# Altium project FLXControl.PrjPCB
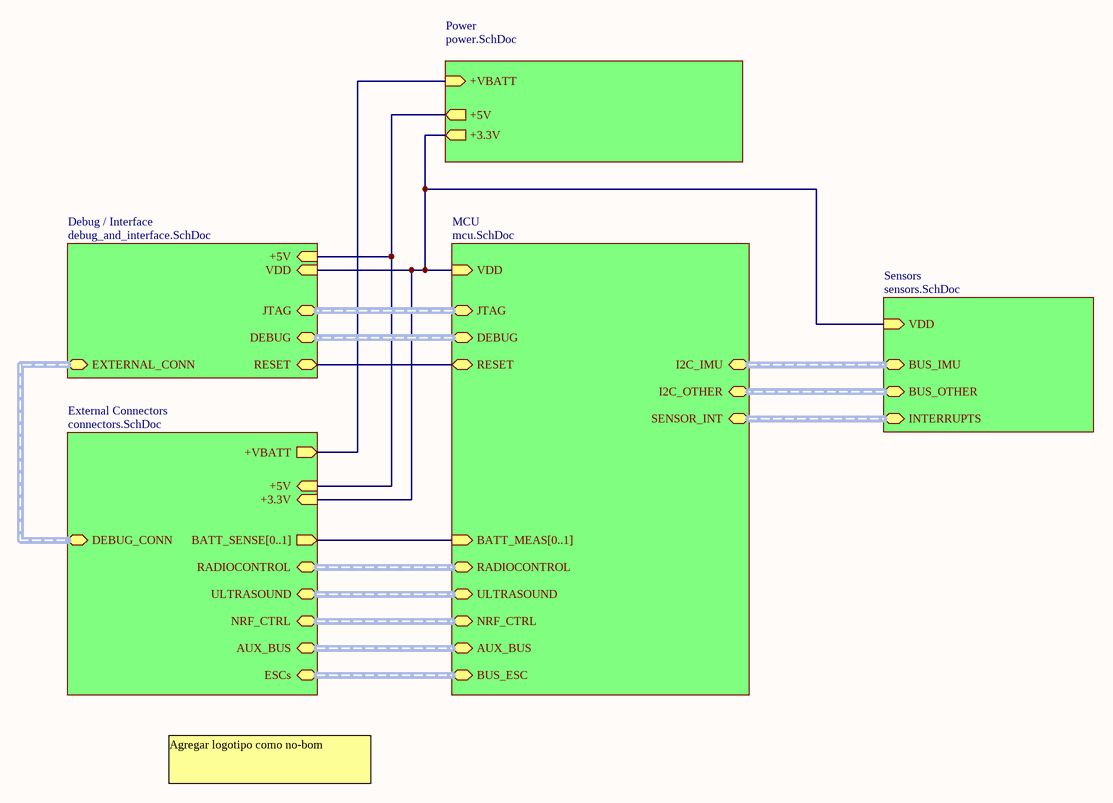
[diagram p0: top_level.SchDoc]
organization: Flying Automatons; Revision: 0
7 sheets, 164 parts. Net scope: hierarchical (ports join the sheet entries above them; power ports are global).
Board file: FLX5.PcbDoc
Sheets:
  top_level.SchDoc
    MCU = mcu.SchDoc
    Sensors = sensors.SchDoc
    Debug / Interface = debug_and_interface.SchDoc
    Power = power.SchDoc
    External Connectors = connectors.SchDoc
      EscConnector1 = esc_connector.SchDoc
      EscConnector2 = esc_connector.SchDoc
      EscConnector3 = esc_connector.SchDoc
      EscConnector4 = esc_connector.SchDoc
      EscConnector5 = esc_connector.SchDoc
      EscConnector6 = esc_connector.SchDoc
      EscConnector7 = esc_connector.SchDoc
      EscConnector8 = esc_connector.SchDoc

## Sheet top_level.SchDoc: Top Level Block Diagram
size A4; DrawnBy: Juan I Carrano; DocumentNumber: 1; SheetNumber: 1; SheetTotal: 6

### Sub-sheets
Debug / Interface = debug_and_interface.SchDoc: VDD (in), JTAG (harness JTAG/SWD), DEBUG (harness Debug), RESET, EXTERNAL_CONN (harness ext_debug), +5V (in)
External Connectors = connectors.SchDoc: ESCs (harness SPI_BUS8), NRF_CTRL (harness nrf_ctrl), RADIOCONTROL (harness RC), BATT_SENSE[0..1] (out), +VBATT (out), AUX_BUS (harness SPI), +5V (in), +3.3V (in), ULTRASOUND (harness ultrasound), DEBUG_CONN (harness ext_debug)
MCU = mcu.SchDoc: JTAG (harness JTAG/SWD), VDD (in), DEBUG (harness Debug), BATT_MEAS[0..1] (in), I2C_IMU (harness i2c), I2C_OTHER (harness i2c), BUS_ESC (harness SPI_BUS8), RESET, RADIOCONTROL (harness RC), SENSOR_INT (harness sensor_interrupts), NRF_CTRL (harness nrf_ctrl), ULTRASOUND (harness ultrasound), AUX_BUS (harness SPI)
Power = power.SchDoc: +VBATT (in), +3.3V (out), +5V (out)
Sensors = sensors.SchDoc: VDD (in), BUS_IMU (harness i2c), INTERRUPTS (harness sensor_interrupts), BUS_OTHER (harness i2c)

### Nets
+5V: sheet Debug / Interface/+5V, sheet Power/+5V, sheet External Connectors/+5V
BATT_MAIN: sheet Power/+VBATT, sheet External Connectors/+VBATT
V3.3: sheet MCU/VDD, sheet Sensors/VDD, sheet Debug / Interface/VDD, sheet Power/+3.3V, sheet External Connectors/+3.3V
Ne~{t}RST_1: sheet MCU/RESET, sheet Debug / Interface/RESET

### Buses and harness runs
bus sheet External Connectors/BATT_SENSE[0..1] = sheet MCU/BATT_MEAS[0..1]
harness sheet Debug / Interface/DEBUG = sheet MCU/DEBUG
harness sheet Debug / Interface/EXTERNAL_CONN = sheet External Connectors/DEBUG_CONN
harness sheet Debug / Interface/JTAG = sheet MCU/JTAG
harness sheet External Connectors/AUX_BUS = sheet MCU/AUX_BUS
harness sheet External Connectors/ESCs = sheet MCU/BUS_ESC
harness sheet External Connectors/NRF_CTRL = sheet MCU/NRF_CTRL
harness sheet External Connectors/RADIOCONTROL = sheet MCU/RADIOCONTROL
harness sheet External Connectors/ULTRASOUND = sheet MCU/ULTRASOUND
harness sheet MCU/I2C_IMU = sheet Sensors/BUS_IMU
harness sheet MCU/I2C_OTHER = sheet Sensors/BUS_OTHER
harness sheet MCU/SENSOR_INT = sheet Sensors/INTERRUPTS

### Notes on the sheet
- Agregar logotipo como no-bom
- Title
- Size:
- Date:
- A4
- Number:
- Time:
- Revision:
- Sheet
- of
- File:
- Drawn by:

## Sheet mcu.SchDoc: Microcontroller
size A4; DrawnBy: Juan I Carrano; DocumentNumber: 3; SheetNumber: 3; SheetTotal: 6
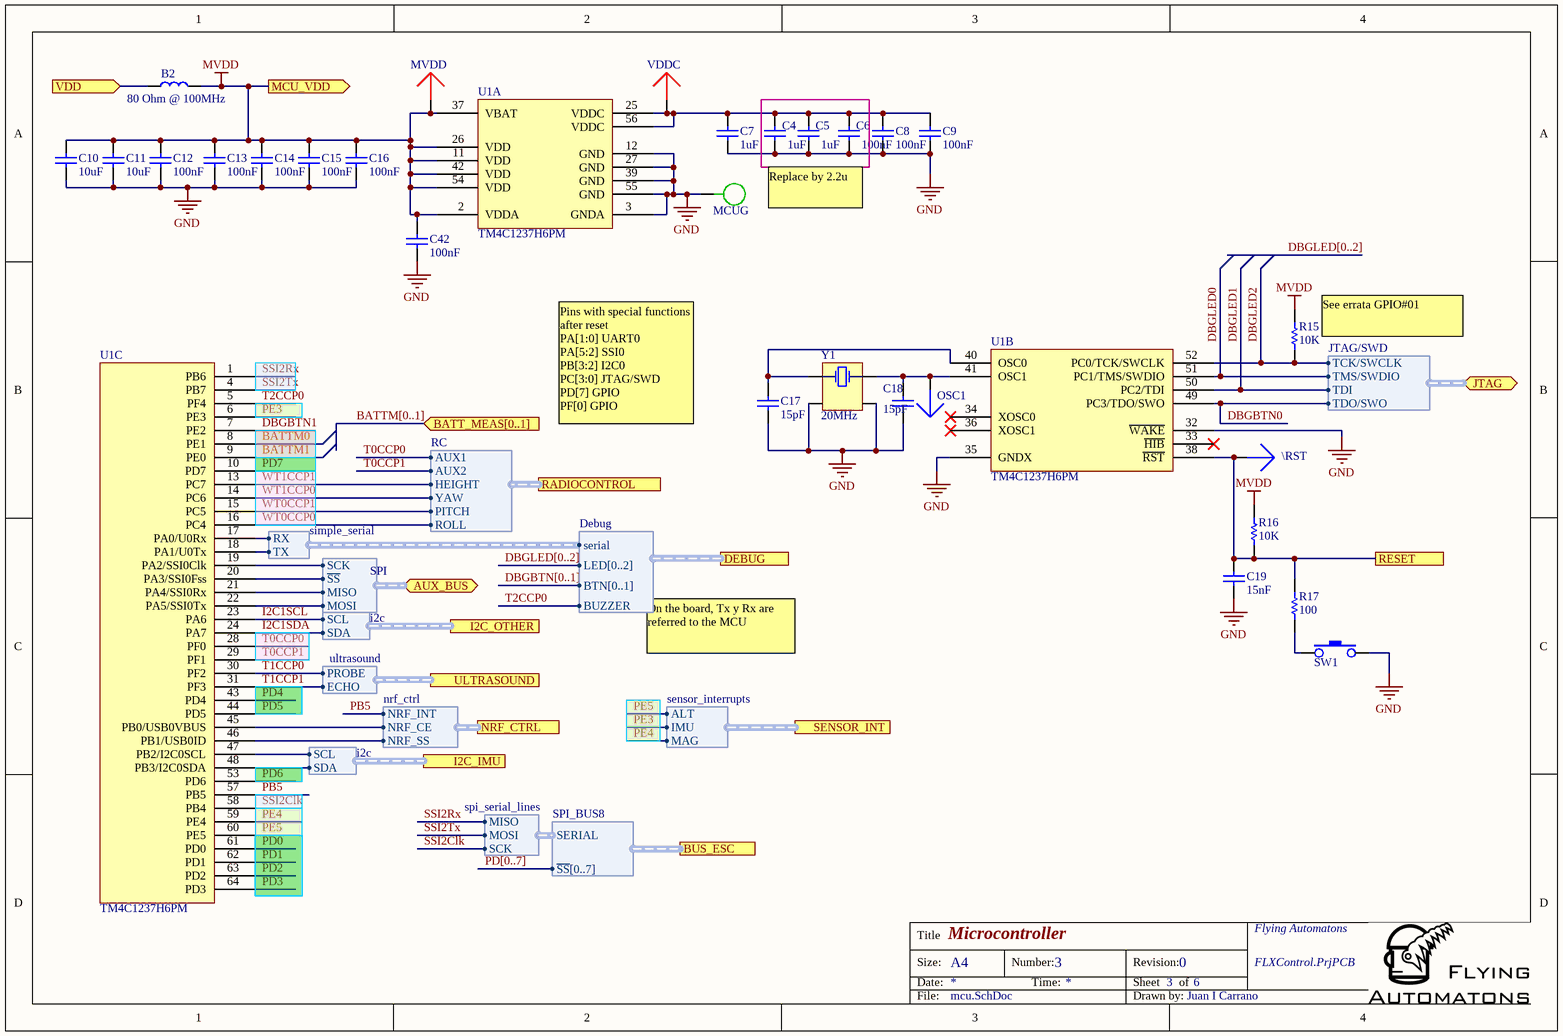
[diagram p1: mcu.SchDoc]

### Parts
\RST  TESTPOINT-ARROW-BLUE  [G-PIN_1mm-CIRCLE]  (value not drawn)
B2  80 Ohm @ 100MHz  [INDC1608L]
C4  1uF  [CAPC1608L]
C5  1uF  [CAPC1608L]
C6  100nF  [CAPC1608L]
C7  1uF  [CAPC1608L]
C8  100nF  [CAPC1608L]
C9  100nF  [CAPC1608L]
C10  10uF  [CAPC3216L]
C11  10uF  [CAPC3216L]
C12  100nF  [CAPC1608L]
C13  100nF  [CAPC1608L]
C14  100nF  [CAPC1608L]
C15  100nF  [CAPC1608L]
C16  100nF  [CAPC1608L]
C17  15pF  [CAPC1608L]
C18  15pF  [CAPC1608L]
C19  15nF  [CAPC1608L]
C42  100nF  [CAPC1608L]
MCUG  TESTPOINT-CIRCLE-GREEN  [G-PIN_1mm-CROSS]  (value not drawn)
MVDD  TESTPOINT-ARROW-RED  [G-PIN_1mm-CIRCLE]  (value not drawn)
OSC1  TESTPOINT-ARROW-BLUE  [G-PIN_1mm-CIRCLE]  (value not drawn)
R15  10K  [RESC1608L]
R16  10K  [RESC1608L]
R17  100  [RESC1608L]
SW1  SWITCH_TACTILE_SPST-2T-NO  [G-SWITCH-M7.1x6.6AS3.25-2T_TH]  (value not drawn)
U1  Manufacturer Part Number: TM4C1237H6PM  [JEDEC_MS-026ACD(D)]  (hidden comment: TM4C1237xxPM)  (parts A,B,C of 3)
VDDC  TESTPOINT-ARROW-RED  [G-PIN_1mm-CIRCLE]  (value not drawn)
Y1  20MHz  [X-EPSO_TSX-3225]

### Ports
AUX_BUS (harness SPI), BATT_MEAS[0..1] (in), BUS_ESC (harness SPI_BUS8), DEBUG (harness Debug), I2C_IMU (harness i2c), I2C_OTHER (harness i2c), JTAG (harness JTAG/SWD), MCU_VDD (out), NRF_CTRL (harness nrf_ctrl), RADIOCONTROL (harness RC), RESET, SENSOR_INT (harness sensor_interrupts), ULTRASOUND (harness ultrasound), VDD (in)

### Harnesses
JTAG/SWD: TCK/SWCLK, TDI, TDO/SWO, TMS/SWDIO
simple_serial: RX, TX
SPI: ~{SS}, MISO, MOSI, SCK
Debug: serial, LED[0..2], BTN[0..1], BUZZER
RC: HEIGHT, ROLL, PITCH, YAW, AUX1, AUX2
SPI_BUS8: SERIAL, ~{SS}[0..7]
sensor_interrupts: ALT, IMU, MAG
i2c: SCL, SDA
ultrasound: PROBE, ECHO
spi_serial_lines: MISO, MOSI, SCK
nrf_ctrl: NRF_SS, NRF_CE, NRF_INT

### Nets
GND: C4.2 C5.2 C6.2 C7.2 C8.2 C9.2 C10.2 C11.2 C12.2 C13.2 C14.2 C15.2 C16.2 C17.2 C18.2 C19.2 C42.2 MCUG.1 SW1.2 U1.3(GNDA) U1.12(GND) U1.27(GND) U1.32(~{WAKE}) U1.35(GNDX) U1.39(GND) U1.55(GND) Y1.2 Y1.4
MVDD: B2.2 C10.1 C11.1 C12.1 C13.1 C14.1 C15.1 C16.1 C42.1 MVDD.1 R15.1 R16.1 U1.2(VDDA) U1.11(VDD) U1.26(VDD) U1.37(VBAT) U1.42(VDD) U1.54(VDD) ; port MCU_VDD
V3.3: B2.1 ; port VDD
BATTM0: U1.8(PE1)
BATTM1: U1.9(PE0)
DBGBTN0: U1.49(PC3/TDO/SWO) ; port JTAG.TDO/SWO  [project net BTN0]
DBGBTN1: U1.7(PE2)  [project net BTN1]
DBGLED0: U1.51(PC1/TMS/SWDIO) ; port JTAG.TMS/SWDIO
DBGLED1: U1.50(PC2/TDI) ; port JTAG.TDI
DBGLED2: R15.2 U1.52(PC0/TCK/SWCLK) ; port JTAG.TCK/SWCLK
I2C1SCL: U1.23(PA6) ; port I2C_OTHER.SCL
I2C1SDA: U1.24(PA7) ; port I2C_OTHER.SDA
NRF_CE: U1.45(PB0/USB0VBUS) ; port NRF_CTRL.NRF_CE
NRF_CSN: U1.46(PB1/USB0ID) ; port NRF_CTRL.NRF_SS
NRF_MISO: U1.21(PA4/SSI0Rx) ; port AUX_BUS.MISO
NRF_MOSI: U1.22(PA5/SSI0Tx) ; port AUX_BUS.MOSI
NRF_SCK: U1.19(PA2/SSI0Clk) ; port AUX_BUS.SCK
PB5: U1.57(PB5) ; port NRF_CTRL.NRF_INT  [project net NRF_IRQ]
PD0: U1.61(PD0)
PD1: U1.62(PD1)
PD2: U1.63(PD2)
PD3: U1.64(PD3)
PD4: U1.43(PD4)
PD5: U1.44(PD5)
PD6: U1.53(PD6)
PD7: U1.10(PD7)
PE3: U1.6(PE3) ; port SENSOR_INT.IMU  [project net INT_IMU]
PE4: U1.59(PE4) ; port SENSOR_INT.MAG  [project net INT_MAG]
PE5: U1.60(PE5) ; port SENSOR_INT.ALT  [project net INT_ALT]
SSI2Clk: U1.58(PB4) ; harness spi_serial_lines.SCK
SSI2Rx: U1.1(PB6) ; harness spi_serial_lines.MISO
SSI2Tx: U1.4(PB7) ; harness spi_serial_lines.MOSI
T0CCP0: U1.28(PF0) ; port RADIOCONTROL.AUX1
T0CCP1: U1.29(PF1) ; port RADIOCONTROL.AUX2
T1CCP0: U1.30(PF2) ; port ULTRASOUND.PROBE
T1CCP1: U1.31(PF3) ; port ULTRASOUND.ECHO
T2CCP0: U1.5(PF4) ; port DEBUG.BUZZER
WT0CCP0: U1.16(PC4) ; port RADIOCONTROL.ROLL
WT0CCP1: U1.15(PC5) ; port RADIOCONTROL.PITCH
WT1CCP0: U1.14(PC6) ; port RADIOCONTROL.YAW
WT1CCP1: U1.13(PC7) ; port RADIOCONTROL.HEIGHT
Ne~{t}RST_1: \RST.1 C19.1 R16.2 R17.1 U1.38(~{RST}) ; port RESET
NetASS_1: U1.20(PA3/SSI0Fss) ; port AUX_BUS.~{SS}
NetC4_1: C4.1 C5.1 C6.1 C7.1 C8.1 C9.1 U1.25(VDDC) U1.56(VDDC) VDDC.1
NetC17_1: C17.1 U1.40(OSC0) Y1.1
NetC18_1: C18.1 OSC1.1 U1.41(OSC1) Y1.3
NetDRX_1: U1.17(PA0/U0Rx) ; harness simple_serial.RX
NetDTX_1: U1.18(PA1/U0Tx) ; harness simple_serial.TX
NetR17_2: R17.2 SW1.1
NetR23_2: U1.47(PB2/I2C0SCL) ; port I2C_IMU.SCL
NetR24_2: U1.48(PB3/I2C0SDA) ; port I2C_IMU.SDA

Not connected (* = marked no-connect by the designer): U1 33(~{HIB})* 34(XOSC0)* 36(XOSC1)*

### Buses and harness runs
bus BATTM[0..1] = port BATT_MEAS[0..1]
bus DBGBTN[0..1]
bus DBGLED[0..2]
bus PD[0..7]

### Notes on the sheet
- Replace by 2.2u
- (near R15) See errata GPIO#01
- Pins with special functions after reset
  PA[1:0] UART0
  PA[5:2] SSI0
  PB[3:2] I2C0
  PC[3:0] JTAG/SWD
  PD[7] GPIO
  PF[0] GPIO
- On the board, Tx y Rx are referred to the MCU
- Title
- Size:
- Date:
- A4
- Number:
- Time:
- Revision:
- Sheet
- of
- File:
- Drawn by:

### Library data of the parts
\RST OSC1 = TESTP_SIG_1mm: Tespoint; Name: TESTP_SIG_1mm
B2 = FERR_80/100M_0603_600m: FERRITE CHIP 80 OHM 600MA 0603; Manufacturer: Samsung Electro-Mechanics America, Inc; Manufacturer Part Number: CIM10U800NC; Name: FERR_80/100M_0603_600m; Value: 80 Ohm @ 100MHz; Supplier 1: Digi-Key; Supplier Part Number 1: 1276-6386-1-ND
C4 C5 C7 = CAP_1u_0603_25V_X5R_10%: CAP CER 1UF 25V 10% X5R 0603; Manufacturer Part Number: TMK107BJ105KA-T; Name: CAP_1u_0603_25V_X5R_10%; Value: 1uF; Supplier 1: Digi-Key; Supplier Part Number 1: 587-1248-1-ND
C6 C8 C9 C12-C16 C42 = CAP_100n_0603_50V_Y5V: CAP CER 0.1UF 50V Y5V 0603; Manufacturer Part Number: CC0603ZRY5V9BB104; Name: CAP_100n_0603_50V_Y5V; Value: 100nF; Supplier 1: Digi-Key; Supplier Part Number 1: 311-1343-1-ND
C10 C11 = CAP_10u_1206_25V_Y5V: CAP CER 10UF 25V Y5V 1206; Manufacturer Part Number: TMK316F106ZL-T; Name: CAP_10u_1206_25V_Y5V; Value: 10uF; Supplier 1: Digi-Key; Supplier Part Number 1: 587-1353-1-ND
C17 C18 = CAP_15p_0603_50V_NP0_5%: CAP CER 15PF 50V 5% NP0 0603; Manufacturer: Samsung Electro-Mechanics America, Inc; Manufacturer Part Number: CL10C150JB8NCNC; Name: CAP_15p_0603_50V_NP0_5%; Value: 15pF; Supplier 1: Digi-Key; Supplier Part Number 1: 1276-2190-1-ND
C19 = CAP_15n_0603_50V_X7R_10%: CAP CER 0.015UF 50V 10% X7R 0603; Manufacturer Part Number: CL10B153KB8SFNC; Name: CAP_15n_0603_50V_X7R_10%; Value: 15nF; Supplier 1: Digi-Key; Supplier Part Number 1: 1276-1967-1-ND
MCUG = TESTP_GND_GREEN_1mm: Ground Connection; Name: TESTP_GND_GREEN_1mm
MVDD VDDC = TESTP_PWR_1mm: Tespoint for Power Trace; Name: TESTP_PWR_1mm
R15 R16 = RES_10K_0603_0W1_1%: RES 10K OHM 1/10W 5% 0603; Manufacturer Part Number: RC1608J103CS; Name: RES_10K_0603_0W1_1%; Value: 10K; Supplier 1: Digi-Key; Supplier Part Number 1: 1276-5086-1-ND
R17 = RES_100_0603_0W1_1%: RES 100 OHM 1/10W 5% 0603 SMD; Manufacturer Part Number: RC0603JR-07100RL; Name: RES_100_0603_0W1_1%; Value: 100; Supplier 1: Digi-Key; Supplier Part Number 1: 311-100GRCT-ND
SW1 = SW_TACT_7.1x6.6mm_S_A5_TH: SWITCH TACTILE SPST-NO 0.05A 12V; Manufacturer: TE Connectivity; Manufacturer Part Number: 1825027-8; Name: SW_TACT_7.1x6.6mm_S_A5_TH; Supplier 1: Digi-Key; Supplier Part Number 1: 450-1657-ND
U1 = x-TI_TM4C1237H6PM: MCU Tiva C-Series 64 Pin LQFP; Manufacturer: Texas Instruments; Name: x-TI_TM4C1237H6PM
Y1 = XTAL_20M_SMD_9p: CRYSTAL 20MHZ 9PF SMD; Manufacturer: EPSON; Manufacturer Part Number: TSX-3225 20.0000MF20G-AC3; Drawn By: Juan I Carrano; Name: XTAL_20M_SMD_9p; Value: 20MHz; Supplier 1: Digi-Key; Supplier Part Number 1: SER3629CT-ND

## Sheet sensors.SchDoc: On-Board Sensors
size A4; DrawnBy: Juan I Carrano; DocumentNumber: 4; SheetNumber: 4; SheetTotal: 6
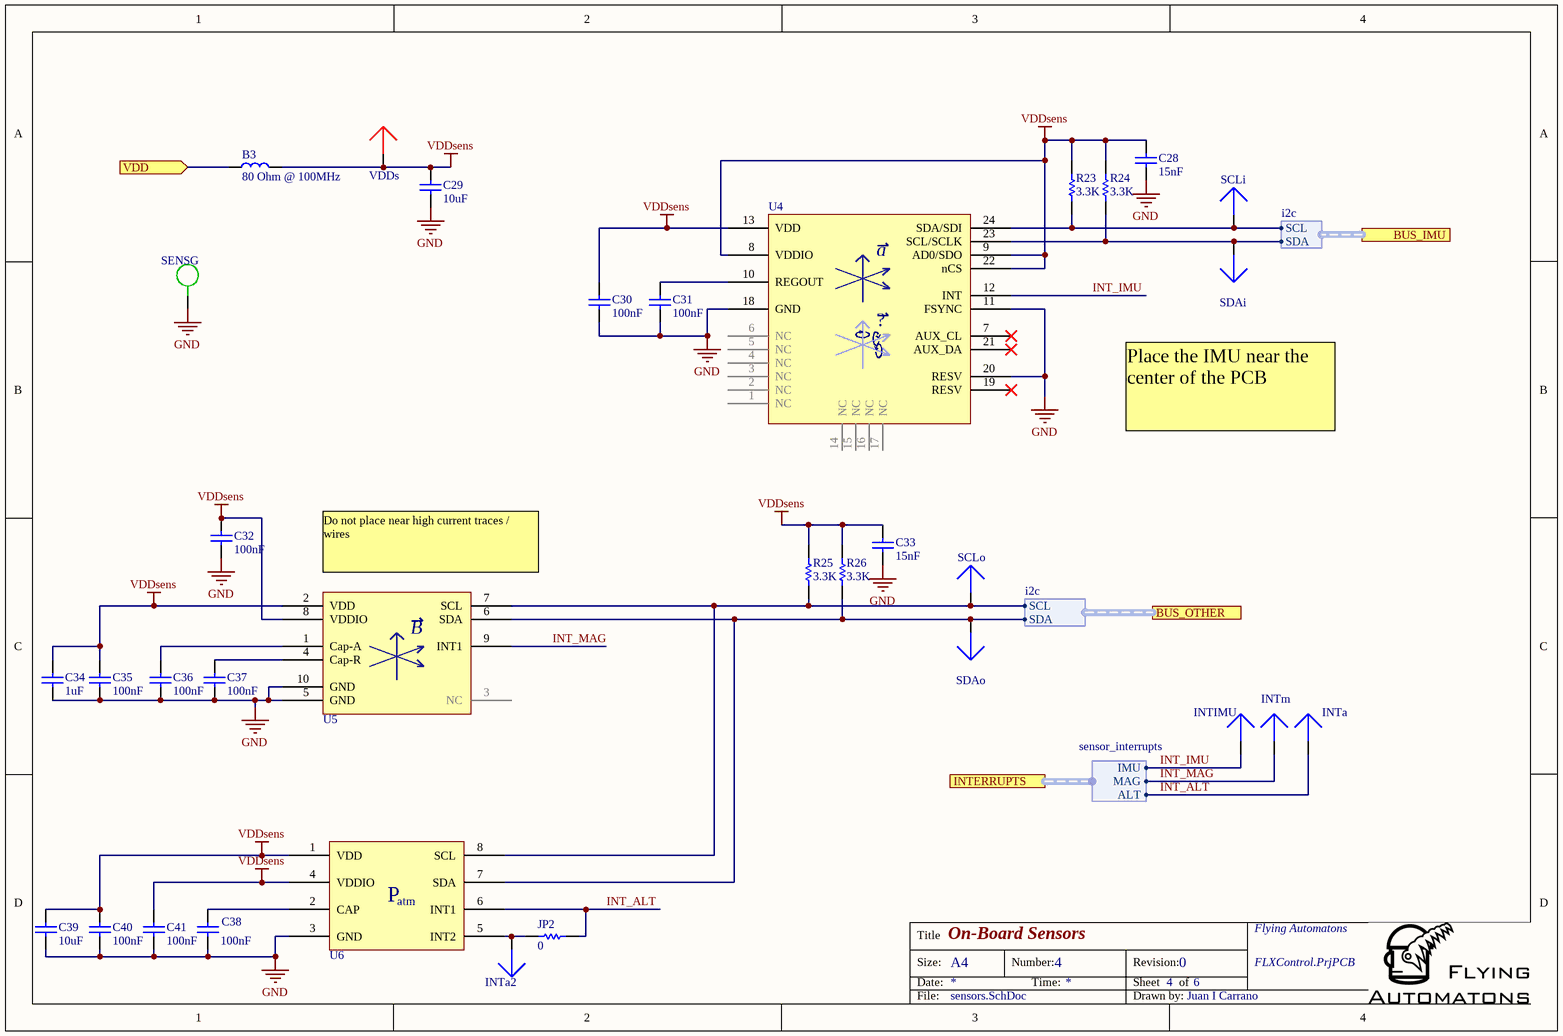
[diagram p2: sensors.SchDoc]

### Parts
B3  80 Ohm @ 100MHz  [INDC1608L]
C28  15nF  [CAPC1608L]
C29  10uF  [CAPC3216L]
C30  100nF  [CAPC1608L]
C31  100nF  [CAPC1608L]
C32  100nF  [CAPC1608L]
C33  15nF  [CAPC1608L]
C34  1uF  [CAPC1608L]
C35  100nF  [CAPC1608L]
C36  100nF  [CAPC1608L]
C37  100nF  [CAPC1608L]
C38  100nF  [CAPC1608L]
C39  10uF  [CAPC3216L]
C40  100nF  [CAPC1608L]
C41  100nF  [CAPC1608L]
INTa  TESTPOINT-ARROW-BLUE  [G-PIN_1mm-CIRCLE]  (value not drawn)
INTa2  TESTPOINT-ARROW-BLUE  [G-PIN_1mm-CIRCLE]  (value not drawn)
INTIMU  TESTPOINT-ARROW-BLUE  [G-PIN_1mm-CIRCLE]  (value not drawn)
INTm  TESTPOINT-ARROW-BLUE  [G-PIN_1mm-CIRCLE]  (value not drawn)
JP2  0  [RESC1608L]
R23  3.3K  [RESC1608L]
R24  3.3K  [RESC1608L]
R25  3.3K  [RESC1608L]
R26  3.3K  [RESC1608L]
SCLi  TESTPOINT-ARROW-BLUE  [G-PIN_1mm-CIRCLE]  (value not drawn)
SCLo  TESTPOINT-ARROW-BLUE  [G-PIN_1mm-CIRCLE]  (value not drawn)
SDAi  TESTPOINT-ARROW-BLUE  [G-PIN_1mm-CIRCLE]  (value not drawn)
SDAo  TESTPOINT-ARROW-BLUE  [G-PIN_1mm-CIRCLE]  (value not drawn)
SENSG  TESTPOINT-CIRCLE-GREEN  [G-PIN_1mm-CROSS]  (value not drawn)
U4  MPU-6500  [QFN40P300X300X95-24N]  (value not drawn)
U5  MAG3110  [SON40P200X200X80-10WL]  (value not drawn)
U6  MPL3115A2  [x-FREE_2053-01(LGA8)]  (value not drawn)
VDDs  TESTPOINT-ARROW-RED  [G-PIN_1mm-CIRCLE]  (value not drawn)

### Ports
BUS_IMU (harness i2c), BUS_OTHER (harness i2c), INTERRUPTS (harness sensor_interrupts), VDD (in)

### Harnesses
sensor_interrupts: IMU, MAG, ALT
i2c: SCL, SDA

### Nets
GND: C28.2 C29.2 C30.2 C31.1 C32.2 C33.2 C34.2 C35.2 C36.2 C37.2 C38.2 C39.2 C40.2 C41.2 SENSG.1 U4.11(FSYNC) U4.18(GND) U4.20(RESV) U5.5(GND) U5.10(GND) U6.3(GND)
V3.3: B3.1 ; port VDD
VDDsens: B3.2 C28.1 C29.1 C30.1 C32.1 C33.1 C34.1 C35.1 C39.1 C40.1 C41.1 R23.1 R24.1 R25.1 R26.1 U4.8(VDDIO) U4.9(AD0/SDO) U4.13(VDD) U4.22(nCS) U5.2(VDD) U5.8(VDDIO) U6.1(VDD) U6.4(VDDIO) VDDs.1
I2C1SCL: R25.2 SCLo.1 U5.7(SCL) U6.8(SCL) ; port BUS_OTHER.SCL
I2C1SDA: R26.2 SDAo.1 U5.6(SDA) U6.7(SDA) ; port BUS_OTHER.SDA
INT_ALT: INTa.1 JP2.1 U6.6(INT1) ; port INTERRUPTS.ALT
INT_IMU: INTIMU.1 U4.12(INT) ; port INTERRUPTS.IMU
INT_MAG: INTm.1 U5.9(INT1) ; port INTERRUPTS.MAG
NetC31_2: C31.2 U4.10(REGOUT)
NetC36_1: C36.1 U5.1(Cap-A)
NetC37_1: C37.1 U5.4(Cap-R)
NetC38_1: C38.1 U6.2(CAP)
NetINTa2_1: INTa2.1 JP2.2 U6.5(INT2)
NetR23_2: R23.2 SCLi.1 U4.24(SDA/SDI) ; port BUS_IMU.SCL
NetR24_2: R24.2 SDAi.1 U4.23(SCL/SCLK) ; port BUS_IMU.SDA

Not connected (* = marked no-connect by the designer): U4 1(NC) 2(NC) 3(NC) 4(NC) 5(NC) 6(NC) 7(AUX_CL)* 14(NC) 15(NC) 16(NC) 17(NC) 19(RESV)* 21(AUX_DA)*; U5 3(NC)

### Notes on the sheet
- Place the IMU near the center of the PCB
- (near U5) Do not place near high current traces / wires
- Title
- Size:
- Date:
- A4
- Number:
- Time:
- Revision:
- Sheet
- of
- File:
- Drawn by:
- (in symbol MAG3110) B
- (in symbol MPL3115A2) P; atm
- (in symbol MPU-6500) a; ?

### Library data of the parts
B3 = FERR_80/100M_0603_600m: as B2 on sheet mcu; Name: FERR_80/100M_0603_600m; Value: 80 Ohm @ 100MHz; Supplier 1: Digi-Key; Supplier Part Number 1: 1276-6386-1-ND
C28 C33 = CAP_15n_0603_50V_X7R_10%: as C19 on sheet mcu; Name: CAP_15n_0603_50V_X7R_10%; Value: 15nF; Supplier 1: Digi-Key; Supplier Part Number 1: 1276-1967-1-ND
C29 C39 = CAP_10u_1206_25V_Y5V: as C10 on sheet mcu; Name: CAP_10u_1206_25V_Y5V; Value: 10uF; Supplier 1: Digi-Key; Supplier Part Number 1: 587-1353-1-ND
C30-C32 C35-C38 C40 C41 = CAP_100n_0603_50V_Y5V: as C6 on sheet mcu; Name: CAP_100n_0603_50V_Y5V; Value: 100nF; Supplier 1: Digi-Key; Supplier Part Number 1: 311-1343-1-ND
C34 = CAP_1u_0603_25V_X5R_10%: as C4 on sheet mcu; Name: CAP_1u_0603_25V_X5R_10%; Value: 1uF; Supplier 1: Digi-Key; Supplier Part Number 1: 587-1248-1-ND
INTa INTa2 INTIMU INTm SCLi SCLo SDAi SDAo = TESTP_SIG_1mm: Tespoint; Name: TESTP_SIG_1mm
JP2 = RES_0_0603_0W1_1%: RES 0.0 OHM 1/10W JUMP 0603; Manufacturer Part Number: RC1608J000CS; Name: RES_0_0603_0W1_1%; Value: 0; Supplier 1: Digi-Key; Supplier Part Number 1: 1276-3510-1-ND
R23-R26 = RES_3K3_0603_0W1_1%: RES 3.3K OHM 1/10W 1% 0603 SMD; Manufacturer: Rohm Semiconductor; Manufacturer Part Number: MCR03ERTF3301; Name: RES_3K3_0603_0W1_1%; Value: 3.3K; Supplier 1: Digi-Key; Supplier Part Number 1: RHM3.30KCFCT-ND
SENSG = TESTP_GND_GREEN_1mm: Ground Connection; Name: TESTP_GND_GREEN_1mm
U4 = MPU-6500: GYRO/ACCELEROMETER 6AXIS 24QFN; Manufacturer: Invensense; Name: MPU-6500; Manufacturer Part Number: MPU-6500; Value: MPU-6500; Supplier 1: Digi-Key; Supplier Part Number 1: 1428-1011-1-ND
U5 = MAG3110: XYZ Digital Magnetometer I2C; Manufacturer: Freescale Semiconductor; Manufacturer Part Number: MAG3110FCR1; Name: MAG3110; Value: MAG3110
U6 = MPL3115A2: IC ALTIMETER I2C VERSION 8LGA; Manufacturer: Freescale Semiconductor; Name: MPL3115A2; Manufacturer Part Number: MPL3115A2; Value: MPL3115A2; Supplier 1: Digi-Key; Supplier Part Number 1: MPL3115A2-ND
VDDs = TESTP_PWR_1mm: Tespoint for Power Trace; Name: TESTP_PWR_1mm

## Sheet debug_and_interface.SchDoc: Debugging / User Interface
size A4; DrawnBy: Juan I Carrano; DocumentNumber: 5; SheetNumber: 5; SheetTotal: 6
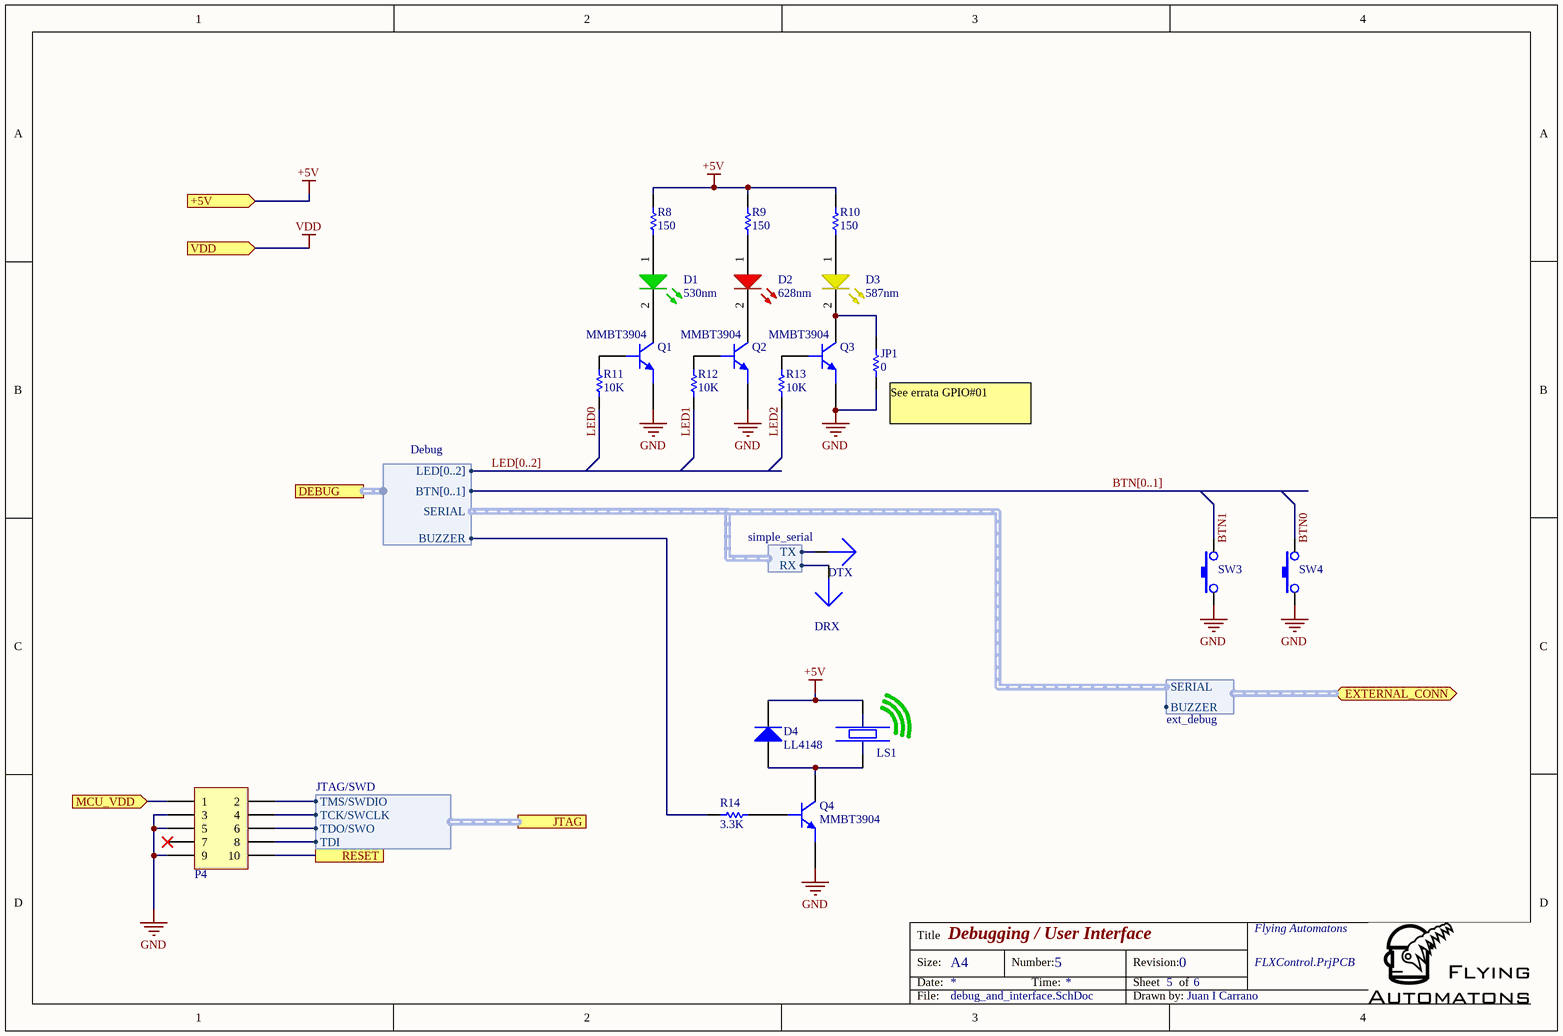
[diagram p3: debug_and_interface.SchDoc]

### Parts
D1  value 530nm  [DSO-F2/D3.4]  (hidden comment: LED-GREEN)
D2  value 628nm  [DSO-F2/D3.4]  (hidden comment: LED-RED)
D3  value 587nm  [DSO-F2/D3.4]  (hidden comment: LED-YELLOW)
D4  value LL4148  [SOD-80]  (hidden comment: DIODE)
DRX  TESTPOINT-ARROW-BLUE  [G-PIN_1mm-CIRCLE]  (value not drawn)
DTX  TESTPOINT-ARROW-BLUE  [G-PIN_1mm-CIRCLE]  (value not drawn)
JP1  0  [RESC1608L]
LS1  (no value)  [TWO_WIRE_HOLE_M0.9D3P]
P4  HEADER-5x2S  [G-HEADER_5x2I.05P_SM]  (value not drawn)
Q1  value MMBT3904  [SOT23-3L]  (hidden comment: BJT-NPN-BEC)
Q2  value MMBT3904  [SOT23-3L]  (hidden comment: BJT-NPN-BEC)
Q3  value MMBT3904  [SOT23-3L]  (hidden comment: BJT-NPN-BEC)
Q4  value MMBT3904  [SOT23-3L]  (hidden comment: BJT-NPN-BEC)
R8  150  [RESC1608L]
R9  150  [RESC1608L]
R10  150  [RESC1608L]
R11  10K  [RESC1608L]
R12  10K  [RESC1608L]
R13  10K  [RESC1608L]
R14  3.3K  [RESC1608L]
SW3  SWITCH_TACTILE_SPST-2T-NO  [G-SWITCH-M7.1x6.6AS3.25-2T_TH]  (value not drawn)
SW4  SWITCH_TACTILE_SPST-2T-NO  [G-SWITCH-M7.1x6.6AS3.25-2T_TH]  (value not drawn)

### Ports
+5V (in), DEBUG (harness Debug), EXTERNAL_CONN (harness ext_debug), JTAG (harness JTAG/SWD), MCU_VDD (in), RESET, VDD (in)

### Harnesses
simple_serial: RX, TX
JTAG/SWD: TCK/SWCLK, TDI, TDO/SWO, TMS/SWDIO
Debug: SERIAL, BTN[0..1], BUZZER, LED[0..2]
ext_debug: BUZZER, SERIAL

### Nets
+5V: D4.2(K) LS1.1 R8.1 R9.1 R10.1 ; port +5V
GND: JP1.2 P4.3 P4.5 P4.9 Q1.2(E) Q2.2(E) Q3.2(E) Q4.2(E) SW3.1 SW4.1
BTN0: P4.6 SW4.2 ; port JTAG.TDO/SWO
BTN1: SW3.2
LED0: P4.2 R11.2 ; port JTAG.TMS/SWDIO  [project net DBGLED0]
LED1: P4.8 R12.2 ; port JTAG.TDI  [project net DBGLED1]
LED2: P4.4 R13.2 ; port JTAG.TCK/SWCLK  [project net DBGLED2]
T2CCP0: R14.2 ; port DEBUG.BUZZER
Ne~{t}RST_1: P4.10 ; port RESET
NetD1_1: D1.1(A) R8.2
NetD1_2: D1.2(K) Q1.3(C)
NetD2_1: D2.1(A) R9.2
NetD2_2: D2.2(K) Q2.3(C)
NetD3_1: D3.1(A) R10.2
NetD3_2: D3.2(K) JP1.1 Q3.3(C)
NetD4_1: D4.1(A) LS1.2 Q4.3(C)
NetDRX_1: DRX.1 ; harness simple_serial.RX
NetDTX_1: DTX.1 ; harness simple_serial.TX
NetP4_1: P4.1 ; port MCU_VDD
NetQ1_1: Q1.1(B) R11.1
NetQ2_1: Q2.1(B) R12.1
NetQ3_1: Q3.1(B) R13.1
NetQ4_1: Q4.1(B) R14.1

Not connected (* = marked no-connect by the designer): P4 7*

### Buses and harness runs
bus BTN[0..1]
bus LED[0..2]

### Notes on the sheet
- (near JP1) See errata GPIO#01
- Title
- Size:
- Date:
- A4
- Number:
- Time:
- Revision:
- Sheet
- of
- File:
- Drawn by:

### Library data of the parts
D1 = LED_GREEN_0603_530: LED CHIPLED 570NM GREEN 0603 SMD; Manufacturer: OSRAM Opto Semiconductors Inc; Manufacturer Part Number: LG Q971-KN-1; Drawn By: Juan I Carrano; Name: LED_GREEN_0603_530; Supplier 1: Digi-Key; Supplier Part Number 1: 475-1409-1-ND
D2 = LED_RED_0603_628: LED POINTLED 628NM SUPER RED SMD; Manufacturer: OSRAM Opto Semiconductors Inc; Manufacturer Part Number: LS Q971-KN-1; Drawn By: Juan I Carrano; Name: LED_RED_0603_628; Supplier 1: Digi-Key; Supplier Part Number 1: 475-3016-1-ND
D3 = LED_YELLOW_0603_587: LED CHIPLED 587NM YLW 0603 SMD; Manufacturer: OSRAM Opto Semiconductors Inc; Manufacturer Part Number: LY Q976-P1S2-36; Drawn By: Juan I Carrano; Name: LED_YELLOW_0603_587; Supplier 1: Digi-Key; Supplier Part Number 1: 475-2558-1-ND
D4 = LL4148: DIODE SMALL SIG 100V 0.2A SOD80; Manufacturer: Fairchild Semiconductor; Drawn By: Juan I Carrano; Name: LL4148; Manufacturer Part Number: LL4148; Supplier 1: Digi-Key; Supplier Part Number 1: LL4148FSCT-ND
DRX DTX = TESTP_SIG_1mm: Tespoint; Name: TESTP_SIG_1mm
JP1 = RES_0_0603_0W1_1%: as JP2 on sheet sensors; Name: RES_0_0603_0W1_1%; Value: 0; Supplier 1: Digi-Key; Supplier Part Number 1: 1276-3510-1-ND
LS1 = PIEZO_BUZZER_EXT: Piezoelectric buzzer (soldered wire); Drawn By: Juan I Carrano; Name: PIEZO_BUZZER_EXT
P4 = HEADER_5x2_50mil_U: CONN HEADER 10POS DL UNSHRD SMD; Name: HEADER_5x2_50mil_U
Q1-Q4 = MMBT3904: TRANSISTOR NPN 40V 0.2A SOT23; Manufacturer: NXP Semiconductors; Name: MMBT3904; Manufacturer Part Number: MMBT3904; Supplier 1: Digi-Key; Supplier Part Number 1: 568-4510-1-ND
R8-R10 = RES_150_0603_0W1_1%: RES 150 OHM 1/10W 1% 0603 SMD; Manufacturer: Rohm Semiconductor; Manufacturer Part Number: MCR03ERTF1500; Name: RES_150_0603_0W1_1%; Value: 150; Supplier 1: Digi-Key; Supplier Part Number 1: RHM150CFCT-ND
R11-R13 = RES_10K_0603_0W1_1%: as R15 on sheet mcu; Name: RES_10K_0603_0W1_1%; Value: 10K; Supplier 1: Digi-Key; Supplier Part Number 1: 1276-5086-1-ND
R14 = RES_3K3_0603_0W1_1%: as R23 on sheet sensors; Name: RES_3K3_0603_0W1_1%; Value: 3.3K; Supplier 1: Digi-Key; Supplier Part Number 1: RHM3.30KCFCT-ND
SW3 SW4 = SW_TACT_7.1x6.6mm_S_A5_TH: as SW1 on sheet mcu; Name: SW_TACT_7.1x6.6mm_S_A5_TH; Supplier 1: Digi-Key; Supplier Part Number 1: 450-1657-ND

## Sheet power.SchDoc: Power Supply
size A4; DrawnBy: Juan I Carrano; DocumentNumber: 2; SheetNumber: 2; SheetTotal: 6
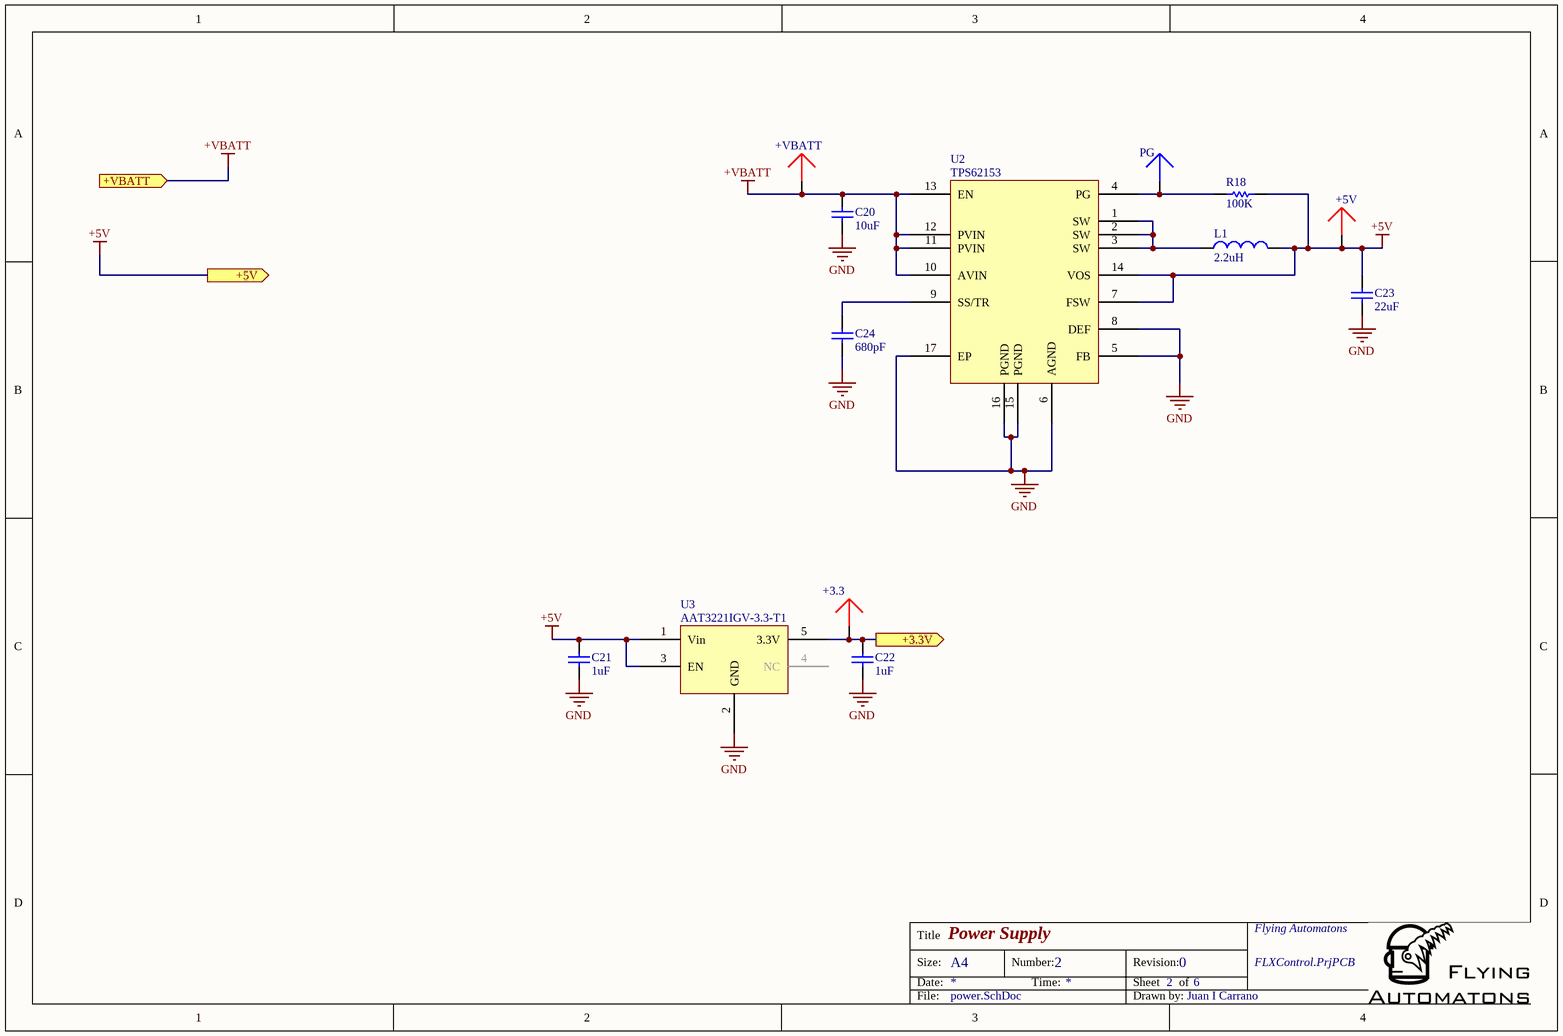
[diagram p4: power.SchDoc]

### Parts
+3.3  TESTPOINT-ARROW-RED  [G-PIN_1mm-CIRCLE]  (value not drawn)
+5V  TESTPOINT-ARROW-RED  [G-PIN_1mm-CIRCLE]  (value not drawn)
+VBATT  TESTPOINT-ARROW-RED  [G-PIN_1mm-CIRCLE]  (value not drawn)
C20  10uF  [CAPC3216L]
C21  1uF  [CAPC1608L]
C22  1uF  [CAPC1608L]
C23  22uF  [CAPC3216L]
C24  680pF  [CAPC1608L]
L1  2.2uH  [X-TDK_FLF3215]
PG  TESTPOINT-ARROW-BLUE  [G-PIN_1mm-CIRCLE]  (value not drawn)
R18  100K  [RESC1608L]
U2  Manufacturer Part Number: TPS62153  [JEDEC_MO-220VEED-4]  (hidden comment: TPS6215x)
U3  Manufacturer Part Number: AAT3221IGV-3.3-T1  [JEDEC_MO-178AA]  (hidden comment: LREG_3T_5pinA_EN_3.3V)

### Ports
+3.3V (out), +5V (out), +VBATT (in)

### Nets
+5V: +5V.1 C21.1 C23.1 L1.2 R18.1 U2.7(FSW) U2.14(VOS) U3.1(Vin) U3.3(EN) ; port +5V
+VBATT: +VBATT.1 C20.1 U2.10(AVIN) U2.11(PVIN) U2.12(PVIN) U2.13(EN) ; port +VBATT  [project net BATT_MAIN]
GND: C20.2 C21.2 C22.2 C23.2 C24.2 U2.5(FB) U2.6(AGND) U2.8(DEF) U2.15(PGND) U2.16(PGND) U2.17(EP) U3.2(GND)
V3.3: +3.3.1 C22.1 U3.5(3.3V) ; port +3.3V
NetC24_1: C24.1 U2.9(SS/TR)
NetL1_1: L1.1 U2.1(SW) U2.2(SW) U2.3(SW)
NetPG_1: PG.1 R18.2 U2.4(PG)

Not connected (* = marked no-connect by the designer): U3 4(NC)

### Notes on the sheet
- Title
- Size:
- Date:
- A4
- Number:
- Time:
- Revision:
- Sheet
- of
- File:
- Drawn by:

### Library data of the parts
+3.3 +5V +VBATT = TESTP_PWR_1mm: Tespoint for Power Trace; Name: TESTP_PWR_1mm
C20 = CAP_10u_1206_25V_Y5V: as C10 on sheet mcu; Name: CAP_10u_1206_25V_Y5V; Value: 10uF; Supplier 1: Digi-Key; Supplier Part Number 1: 587-1353-1-ND
C21 C22 = CAP_1u_0603_25V_X5R_10%: as C4 on sheet mcu; Name: CAP_1u_0603_25V_X5R_10%; Value: 1uF; Supplier 1: Digi-Key; Supplier Part Number 1: 587-1248-1-ND
C23 = CAP_22u_1206_16V_X5R_10%: CAP CER 22UF 16V 10% X5R 1206; Manufacturer: Samsung Electro-Mechanics America, Inc; Manufacturer Part Number: CL31A226KOCLFNC; Name: CAP_22u_1206_16V_X5R_10%; Value: 22uF; Supplier 1: Digi-Key; Supplier Part Number 1: 1276-2725-1-ND
C24 = CAP_680p_0603_50V_NP0_5%: CAP CER 680PF 50V 5% NP0 0603; Manufacturer: Samsung Electro-Mechanics America, Inc; Manufacturer Part Number: CL10C681JB8NFNC; Name: CAP_680p_0603_50V_NP0_5%; Value: 680pF; Supplier 1: Digi-Key; Supplier Part Number 1: 1276-2329-1-ND
L1 = IND_2u2_SMD_1A4_20%_3.2x2.5: INDUCTOR 2.2UH 1.4A 20% SMD; Manufacturer: TDK Corporation; Manufacturer Part Number: FLF3215T-2R2M; Name: IND_2u2_SMD_1A4_20%_3.2x2.5; Value: 2.2uH; Supplier 1: Digi-Key; Supplier Part Number 1: 445-4845-6-ND
PG = TESTP_SIG_1mm: Tespoint; Name: TESTP_SIG_1mm
R18 = RES_100K_0603_0W1_1%: RES 100K OHM 1/10W 1% 0603 SMD; Manufacturer: Rohm Semiconductor; Manufacturer Part Number: MCR03ERTF1003; Name: RES_100K_0603_0W1_1%; Value: 100K; Supplier 1: Digi-Key; Supplier Part Number 1: RHM100KCFCT-ND
U2 = x-TI_TPS62153: 3-17V 1A Step-Down Converter in 3x3 QFN Package; Manufacturer: Texas Instruments; Value: 1A, 5V,  1.25MHz; Drawn By: Juan I Carrano; Name: x-TI_TPS62153; Supplier 1: Texas Instruments
U3 = g-LREG_3V3_0A15_EN_SOT753: 150 mA LDO Linear Regulator, SOT23-5; Manufacturer: Skyworks Solutions Inc; Value: 3.3V, 0.15A; Name: g-LREG_3V3_0A15_EN_SOT753; Supplier 1: Digi-Key; Supplier Part Number 1: 863-1491-1-ND

## Sheet connectors.SchDoc: Connection to external devices
size A4; DrawnBy: Juan I Carrano; DocumentNumber: 6; SheetNumber: 6; SheetTotal: 7
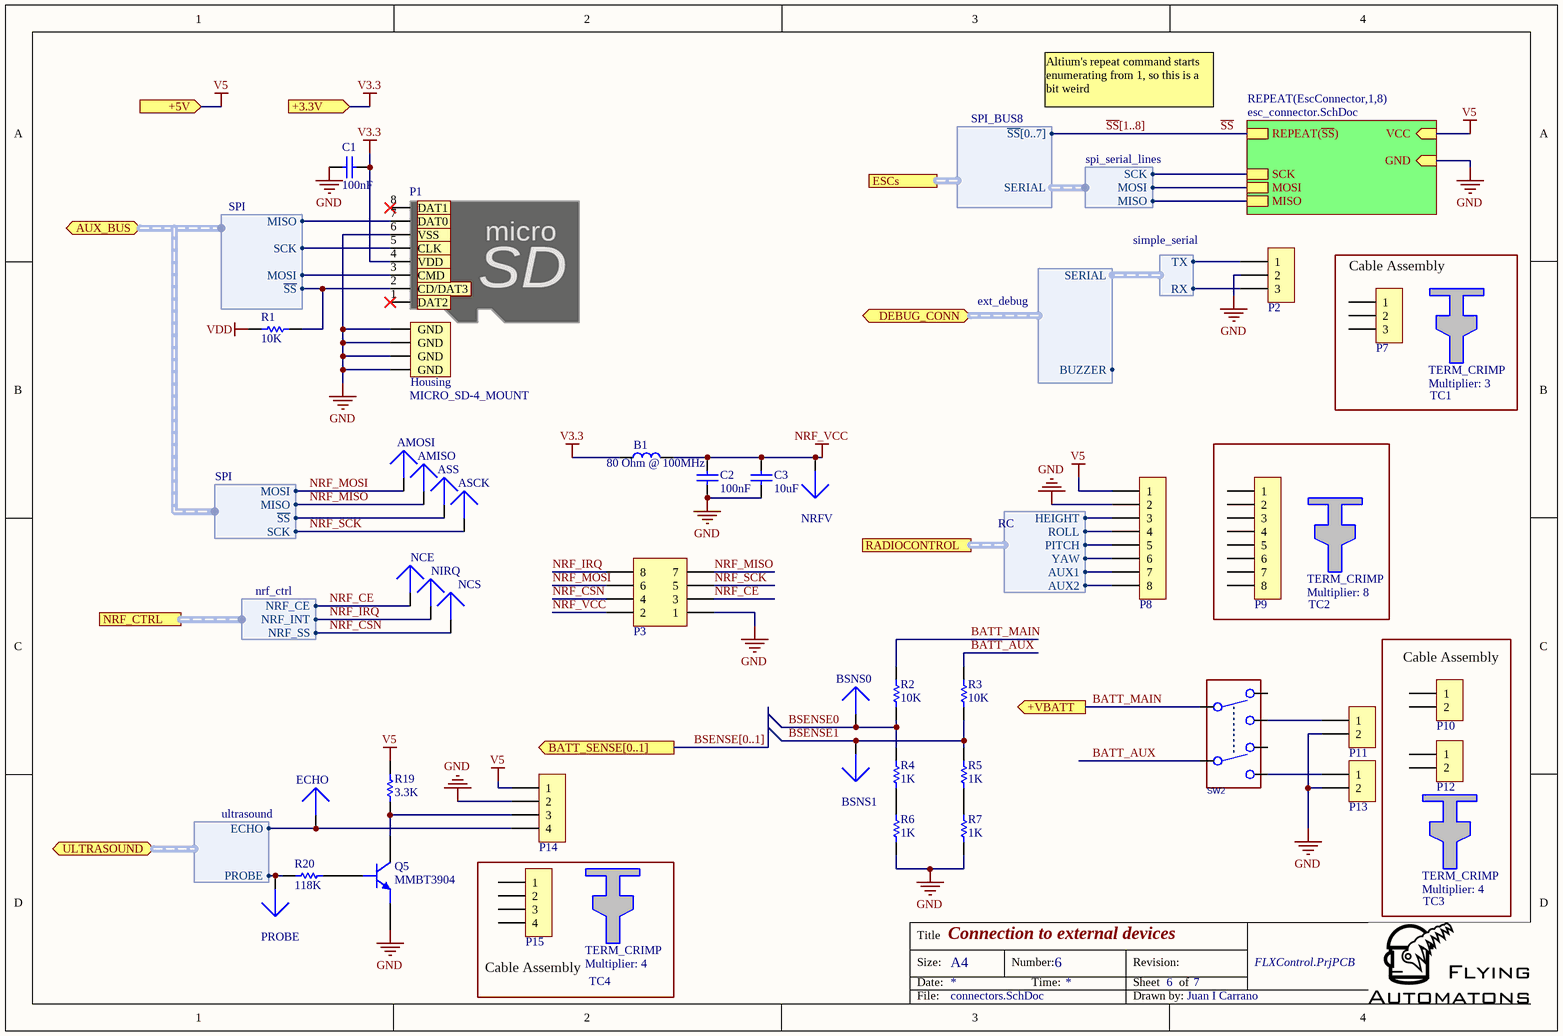
[diagram p5: connectors.SchDoc]

### Parts
AMISO  TESTPOINT-ARROW-BLUE  [G-PIN_1mm-CIRCLE]  (value not drawn)
AMOSI  TESTPOINT-ARROW-BLUE  [G-PIN_1mm-CIRCLE]  (value not drawn)
ASCK  TESTPOINT-ARROW-BLUE  [G-PIN_1mm-CIRCLE]  (value not drawn)
ASS  TESTPOINT-ARROW-BLUE  [G-PIN_1mm-CIRCLE]  (value not drawn)
B1  80 Ohm @ 100MHz  [INDC1608L]
BSNS0  TESTPOINT-ARROW-BLUE  [G-PIN_1mm-CIRCLE]  (value not drawn)
BSNS1  TESTPOINT-ARROW-BLUE  [G-PIN_1mm-CIRCLE]  (value not drawn)
C1  100nF  [CAPC1608L]
C2  100nF  [CAPC1608L]
C3  10uF  [CAPC3216L]
ECHO  TESTPOINT-ARROW-BLUE  [G-PIN_1mm-CIRCLE]  (value not drawn)
NCE  TESTPOINT-ARROW-BLUE  [G-PIN_1mm-CIRCLE]  (value not drawn)
NCS  TESTPOINT-ARROW-BLUE  [G-PIN_1mm-CIRCLE]  (value not drawn)
NIRQ  TESTPOINT-ARROW-BLUE  [G-PIN_1mm-CIRCLE]  (value not drawn)
NRFV  TESTPOINT-ARROW-BLUE  [G-PIN_1mm-CIRCLE]  (value not drawn)
P1  MICRO_SD-4_MOUNT  [X-MOLX_472192001]
P2  HEADER-3x1  [X-JST-S3B-ZR]  (value not drawn)
P3  HEADER-4x2S  [G-HEADER_4x2I.1P_TH]  (value not drawn)
P7  HEADER-3x1_Mech  (value not drawn)  (mechanical)
P8  HEADER-8x1  [X-JST-S8B-ZR]  (value not drawn)
P9  HEADER-8x1_Mech  (value not drawn)  (mechanical)
P10  HEADER-2x1_Mech  (value not drawn)  (mechanical)
P11  HEADER-2x1  [X-JST-S2B-ZR]  (value not drawn)
P12  HEADER-2x1_Mech  (value not drawn)  (mechanical)
P13  HEADER-2x1  [X-JST-S2B-ZR]  (value not drawn)
P14  HEADER-4x1  [X-JST-S4B-ZR]  (value not drawn)
P15  HEADER-4x1_Mech  (value not drawn)  (mechanical)
PROBE  TESTPOINT-ARROW-BLUE  [G-PIN_1mm-CIRCLE]  (value not drawn)
Q5  value MMBT3904  [SOT23-3L]  (hidden comment: BJT-NPN-BEC)
R1  10K  [RESC1608L]
R2  10K  [RESC1608L]
R3  10K  [RESC1608L]
R4  1K  [RESC1608L]
R5  1K  [RESC1608L]
R6  1K  [RESC1608L]
R7  1K  [RESC1608L]
R19  3.3K  [RESC1608L]
R20  118K  [RESC1608L]
SW2  SWITCH-SLIDE-DPDT-LNK  [X-CKC_JS202011AQN]  (value not drawn)
TC1  TERM_CRIMP  Multiplier: 3  (mechanical)
TC2  TERM_CRIMP  Multiplier: 8  (mechanical)
TC3  TERM_CRIMP  Multiplier: 4  (mechanical)
TC4  TERM_CRIMP  Multiplier: 4  (mechanical)

### Blocks framed on the sheet
Cable Assembly: P7 TC1
Cable Assembly: P10 P12 TC3
Cable Assembly: P15 TC4

### Sub-sheets
REPEAT(EscConnector,1,8) = esc_connector.SchDoc: REPEAT(~{SS}), SCK, VCC (in), GND (in), MOSI, MISO

### Ports
+3.3V (in), +5V (in), +VBATT (out), AUX_BUS (harness SPI), BATT_SENSE[0..1] (out), DEBUG_CONN (harness ext_debug), ESCs (harness SPI_BUS8), NRF_CTRL (harness nrf_ctrl), RADIOCONTROL (harness RC), ULTRASOUND (harness ultrasound)

### Harnesses
SPI_BUS8: SERIAL, ~{SS}[0..7]
spi_serial_lines: MISO, MOSI, SCK
ultrasound: PROBE, ECHO
RC: HEIGHT, ROLL, PITCH, YAW, AUX1, AUX2
ext_debug: SERIAL, BUZZER
simple_serial: RX, TX
SPI: SCK, ~{SS}, MISO, MOSI
nrf_ctrl: NRF_INT, NRF_CE, NRF_SS

### Nets
BATT_MAIN: R2.1 SW2.A1 ; port +VBATT
GND: C1.2 C2.2 C3.2 P1.6(VSS) P1.MOUNT1(GND) P1.MOUNT2(GND) P1.MOUNT3(GND) P1.MOUNT4(GND) P2.2 P3.1 P8.2 P11.2 P13.2 P14.2 Q5.2(E) R6.2 R7.2 ; sheet REPEAT(EscConnector,1,8)/GND
NRF_VCC: B1.2 C2.1 C3.1 NRFV.1 P3.2
V3.3: B1.1 C1.1 P1.4(VDD) R1.2 ; port +3.3V  [also labelled VDD]
V5: P8.1 P14.1 R19.1 ; port +5V, sheet REPEAT(EscConnector,1,8)/VCC  [project net +5V]
BATT_AUX: R3.1 SW2.A2
BSENSE0: BSNS0.1 R2.2 R4.1  [project net BATTM0]
BSENSE1: BSNS1.1 R3.2 R5.1  [project net BATTM1]
NRF_CE: NCE.1 P3.3 ; port NRF_CTRL.NRF_CE
NRF_CSN: NCS.1 P3.4 ; port NRF_CTRL.NRF_SS
NRF_IRQ: NIRQ.1 P3.8 ; port NRF_CTRL.NRF_INT
NRF_MISO: AMISO.1 P1.7(DAT0) P3.7 ; port AUX_BUS.MISO
NRF_MOSI: AMOSI.1 P1.3(CMD) P3.6 ; port AUX_BUS.MOSI
NRF_SCK: ASCK.1 P1.5(CLK) P3.5 ; port AUX_BUS.SCK
~{SS}: sheet REPEAT(EscConnector,1,8)/REPEAT(~{SS})
SSI2Clk: sheet REPEAT(EscConnector,1,8)/SCK, harness spi_serial_lines.SCK
SSI2Rx: sheet REPEAT(EscConnector,1,8)/MISO, harness spi_serial_lines.MISO
SSI2Tx: sheet REPEAT(EscConnector,1,8)/MOSI, harness spi_serial_lines.MOSI
T0CCP0: P8.7 ; port RADIOCONTROL.AUX1
T0CCP1: P8.8 ; port RADIOCONTROL.AUX2
T1CCP0: PROBE.1 R20.2 ; port ULTRASOUND.PROBE
T1CCP1: ECHO.1 P14.4 ; port ULTRASOUND.ECHO
WT0CCP0: P8.4 ; port RADIOCONTROL.ROLL
WT0CCP1: P8.5 ; port RADIOCONTROL.PITCH
WT1CCP0: P8.6 ; port RADIOCONTROL.YAW
WT1CCP1: P8.3 ; port RADIOCONTROL.HEIGHT
NetASS_1: ASS.1 P1.2(CD/DAT3) R1.1 ; port AUX_BUS.~{SS}
NetDRX_1: P2.3 ; harness simple_serial.RX
NetDTX_1: P2.1 ; harness simple_serial.TX
NetP11_1: P11.1 SW2.C1
NetP13_1: P13.1 SW2.C2
NetP14_3: P14.3 Q5.3(C) R19.2
NetQ5_1: Q5.1(B) R20.1
NetR4_2: R4.2 R6.1
NetR5_2: R5.2 R7.1

Not connected (* = marked no-connect by the designer): P1 1(DAT2)* 8(DAT1)*; P7 1 2 3; P9 1 2 3 4 5 6 7 8; P10 1 2; P12 1 2; P15 1 2 3 4; SW2 B1 B2

### Buses and harness runs
bus BSENSE[0..1] = port BATT_SENSE[0..1]
bus ~{SS}[1..8]

### Notes on the sheet
- Altium's repeat command starts enumerating from 1, so this is a bit weird
- Title
- Size:
- Date:
- A4
- Number:
- Time:
- Revision:
- Sheet
- of
- File:
- Drawn by:
- (in symbol CONN_MICRO_SD-4_MOUNT) micro; SD; Housing

### Library data of the parts
AMISO AMOSI ASCK ASS BSNS0 BSNS1 ECHO NCE NCS NIRQ NRFV PROBE = TESTP_SIG_1mm: Tespoint; Name: TESTP_SIG_1mm
B1 = FERR_80/100M_0603_600m: as B2 on sheet mcu; Name: FERR_80/100M_0603_600m; Value: 80 Ohm @ 100MHz; Supplier 1: Digi-Key; Supplier Part Number 1: 1276-6386-1-ND
C1 C2 = CAP_100n_0603_50V_Y5V: as C6 on sheet mcu; Name: CAP_100n_0603_50V_Y5V; Value: 100nF; Supplier 1: Digi-Key; Supplier Part Number 1: 311-1343-1-ND
C3 = CAP_10u_1206_25V_Y5V: as C10 on sheet mcu; Name: CAP_10u_1206_25V_Y5V; Value: 10uF; Supplier 1: Digi-Key; Supplier Part Number 1: 587-1353-1-ND
P1 = CONN_MICRO_SD-4_MOUNT: CONN MEMORY CARD R/A 8POS SMD; Manufacturer: Molex; Manufacturer Part Number: 472192001; Name: CONN_MICRO_SD-4_MOUNT; Supplier 1: Digi-Key; Supplier Part Number 1: WM6698CT-ND
P2 = HEADER_3x1_1.5mm_ZH_TH: CONN HEADER ZH SIDE 3POS 1.5MM; Manufacturer: JST Sales America Inc; Manufacturer Part Number: S3B-ZR(LF)(SN); Name: HEADER_3x1_1.5mm_ZH_TH; Supplier 1: Digi-Key; Supplier Part Number 1: 455-1670-ND
P3 = HEADER_4x2_100mil_F: CONN HEADER FMAL 8PS .1" DL GOLD; Name: HEADER_4x2_100mil_F; Supplier 1: SyC; Supplier Part Number 1: PB08D-H
P7 = HOUSING_3x1_1.5mm_ZH: CONN HOUSING ZH 3POS 1.5MM WHT; Manufacturer: JST Sales America Inc; Manufacturer Part Number: ZHR-3; Name: HOUSING_3x1_1.5mm_ZH; Supplier 1: Digi-Key; Supplier Part Number 1: 455-1160-ND
P8 = HEADER_8x1_1.5mm_ZH_TH: CONN HEADER ZH SIDE 8POS 1.5MM; Manufacturer: JST Sales America Inc; Manufacturer Part Number: S8B-ZR(LF)(SN); Name: HEADER_8x1_1.5mm_ZH_TH; Supplier 1: Digi-Key; Supplier Part Number 1: 455-1675-ND
P9 = HOUSING_8x1_1.5mm_ZH: CONN HOUSING ZH 8POS 1.5MM WHT; Manufacturer: JST Sales America Inc; Manufacturer Part Number: ZHR-8; Name: HOUSING_8x1_1.5mm_ZH; Supplier 1: Digi-Key; Supplier Part Number 1: 455-1199-ND
P10 P12 = HOUSING_2x1_1.5mm_ZH: CONN HOUSING ZH 2POS 1.5MM WHT; Manufacturer: JST Sales America Inc; Manufacturer Part Number: ZHR-2; Name: HOUSING_2x1_1.5mm_ZH; Supplier 1: Digi-Key; Supplier Part Number 1: 455-1366-ND
P11 P13 = HEADER_2x1_1.5mm_ZH_TH: CONN HEADER ZH SIDE 2POS 1.5MM; Manufacturer: JST Sales America Inc; Manufacturer Part Number: S2B-ZR(LF)(SN); Name: HEADER_2x1_1.5mm_ZH_TH; Supplier 1: Digi-Key; Supplier Part Number 1: 455-1669-ND
P14 = HEADER_4x1_1.5mm_ZH_TH: CONN HEADER ZH SIDE 4POS 1.5MM; Manufacturer: JST Sales America Inc; Manufacturer Part Number: S4B-ZR(LF)(SN); Name: HEADER_4x1_1.5mm_ZH_TH; Supplier 1: Digi-Key; Supplier Part Number 1: 455-1671-ND
P15 = HOUSING_4x1_1.5mm_ZH: CONN HOUSING ZH 4POS 1.5MM WHT; Manufacturer: JST Sales America Inc; Manufacturer Part Number: ZHR-4; Name: HOUSING_4x1_1.5mm_ZH; Supplier 1: Digi-Key; Supplier Part Number 1: 455-1202-ND
Q5 = MMBT3904: as Q1 on sheet debug_and_interface; Name: MMBT3904; Manufacturer Part Number: MMBT3904; Supplier 1: Digi-Key; Supplier Part Number 1: 568-4510-1-ND
R1-R3 = RES_10K_0603_0W1_1%: as R15 on sheet mcu; Name: RES_10K_0603_0W1_1%; Value: 10K; Supplier 1: Digi-Key; Supplier Part Number 1: 1276-5086-1-ND
R4-R7 = RES_1K_0603_0W1_1%: RES 1K OHM 1/10W 5% 0603; Manufacturer Part Number: RMCF0603JT1K00; Name: RES_1K_0603_0W1_1%; Value: 1K; Supplier 1: Digi-Key; Supplier Part Number 1: RMCF0603JT1K00CT-ND
R19 = RES_3K3_0603_0W1_1%: as R23 on sheet sensors; Name: RES_3K3_0603_0W1_1%; Value: 3.3K; Supplier 1: Digi-Key; Supplier Part Number 1: RHM3.30KCFCT-ND
R20 = RES_118K_0603_0W1_1%: RES 118K OHM 1/10W 1% 0603; Manufacturer Part Number: RMCF0603FT118K; Name: RES_118K_0603_0W1_1%; Value: 118K; Supplier 1: Digi-Key; Supplier Part Number 1: RMCF0603FT118KCT-ND
SW2 = SW_SLIDE_DPDT_9x3.6mm_S_A2_TH: SW SLIDE DPDT 6VDC 0.3A PCMNT; Manufacturer: C&K Components; Manufacturer Part Number: JS202011AQN; Drawn By: Juan I Carrano; Name: SW_SLIDE_DPDT_9x3.6mm_S_A2_TH; Value: 0.3A; Supplier 1: Digi-Key; Supplier Part Number 1: 401-2000-ND
TC1-TC4 = TCRIMP_ZH_28-32AWG: CONN TERM CRIMP ZH 28-32AWG TIN; Manufacturer: JST Sales America Inc; Manufacturer Part Number: SZH-003T-P0.5; Name: TCRIMP_ZH_28-32AWG; Supplier 1: Digi-Key; Supplier Part Number 1: 455-1281-1-ND

## Sheet esc_connector.SchDoc: ESC Connector
size A4; DrawnBy: Juan I Carrano
Used 8 times, as channels External Connectors/EscConnector1, External Connectors/EscConnector2, External Connectors/EscConnector3, External Connectors/EscConnector4, External Connectors/EscConnector5, External Connectors/EscConnector6, External Connectors/EscConnector7, External Connectors/EscConnector8. Parts and nets are listed once, with the designators drawn on the sheet.
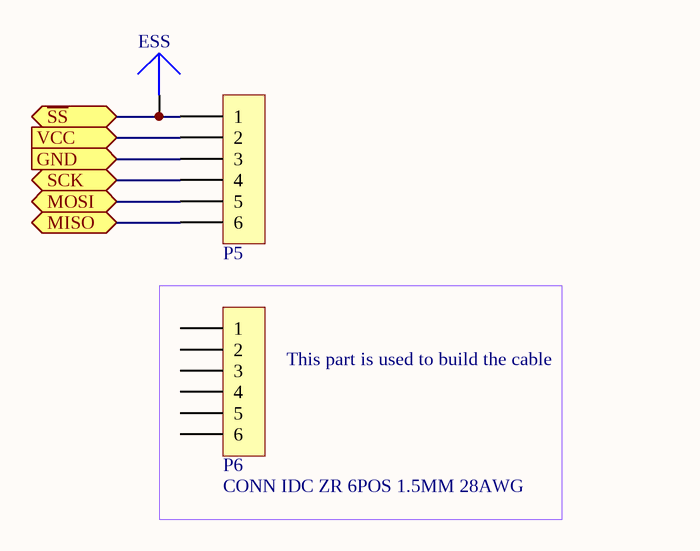
[diagram p6: esc_connector.SchDoc]

### Parts
ESS  TESTPOINT-ARROW-BLUE  [G-PIN_1mm-CIRCLE]  (value not drawn)
P5  HEADER-6x1  [X-JST-S6B-ZR]  (value not drawn)
P6  HEADER-6x1_Mech  (value not drawn)  (mechanical)

### Blocks framed on the sheet
This part is used to build the cable: P6

### Ports
GND (in), MISO, MOSI, SCK, VCC (in), ~{SS}

### Nets
GND: P5.3 ; port GND
MISO: P5.6 ; port MISO
MOSI: P5.5 ; port MOSI
~{SS}: ESS.1 P5.1 ; port ~{SS}
SCK: P5.4 ; port SCK
VCC: P5.2 ; port VCC

Not connected (* = marked no-connect by the designer): P6 1 2 3 4 5 6

### Channels
External Connectors/EscConnector1: designators end in _EscConnector1; ports GND=GND MISO=SSI2Rx MOSI=SSI2Tx SCK=SSI2Clk VCC=+5V ~{SS}=PD0
External Connectors/EscConnector2: designators end in _EscConnector2; ports GND=GND MISO=SSI2Rx MOSI=SSI2Tx SCK=SSI2Clk VCC=+5V ~{SS}=PD1
External Connectors/EscConnector3: designators end in _EscConnector3; ports GND=GND MISO=SSI2Rx MOSI=SSI2Tx SCK=SSI2Clk VCC=+5V ~{SS}=PD2
External Connectors/EscConnector4: designators end in _EscConnector4; ports GND=GND MISO=SSI2Rx MOSI=SSI2Tx SCK=SSI2Clk VCC=+5V ~{SS}=PD3
External Connectors/EscConnector5: designators end in _EscConnector5; ports GND=GND MISO=SSI2Rx MOSI=SSI2Tx SCK=SSI2Clk VCC=+5V ~{SS}=PD4
External Connectors/EscConnector6: designators end in _EscConnector6; ports GND=GND MISO=SSI2Rx MOSI=SSI2Tx SCK=SSI2Clk VCC=+5V ~{SS}=PD5
External Connectors/EscConnector7: designators end in _EscConnector7; ports GND=GND MISO=SSI2Rx MOSI=SSI2Tx SCK=SSI2Clk VCC=+5V ~{SS}=PD6
External Connectors/EscConnector8: designators end in _EscConnector8; ports GND=GND MISO=SSI2Rx MOSI=SSI2Tx SCK=SSI2Clk VCC=+5V ~{SS}=PD7

### Notes on the sheet
- Title
- Size:
- Date:
- A4
- Number:
- Time:
- Revision:
- Sheet
- of
- File:
- Drawn by:

### Library data of the parts
ESS = TESTP_SIG_1mm: Tespoint; Name: TESTP_SIG_1mm
P5 = HEADER_6x1_1.5mm_ZH_TH: CONN HEADER ZH SIDE 6POS 1.5MM; Manufacturer: JST Sales America Inc; Manufacturer Part Number: S6B-ZR(LF)(SN); Name: HEADER_6x1_1.5mm_ZH_TH; Supplier 1: Digi-Key; Supplier Part Number 1: 455-1673-ND
P6 = HEADER_6x1_1.5mm_ZH_TH_Wire: CONN IDC ZR 6POS 1.5MM 28AWG; Manufacturer: JST Sales America Inc; Manufacturer Part Number: 06ZR-8M-P; Name: HEADER_6x1_1.5mm_ZH_TH_Wire; Supplier 1: Digi-Key; Supplier Part Number 1: 455-2293-ND

## Nets that join several sheets
+5V: debug_and_interface (5 pins), power (9 pins), connectors (P8.1 P14.1 R19.1), External Connectors/EscConnector1 (P5_EscConnector1.2), External Connectors/EscConnector2 (P5_EscConnector2.2), External Connectors/EscConnector3 (P5_EscConnector3.2), External Connectors/EscConnector4 (P5_EscConnector4.2), External Connectors/EscConnector5 (P5_EscConnector5.2), External Connectors/EscConnector6 (P5_EscConnector6.2), External Connectors/EscConnector7 (P5_EscConnector7.2), External Connectors/EscConnector8 (P5_EscConnector8.2)
BATT_MAIN: power (6 pins), connectors (R2.1 SW2.A1)
GND: mcu (28 pins), sensors (21 pins), debug_and_interface (10 pins), power (12 pins), connectors (17 pins), External Connectors/EscConnector1 (P5_EscConnector1.3), External Connectors/EscConnector2 (P5_EscConnector2.3), External Connectors/EscConnector3 (P5_EscConnector3.3), External Connectors/EscConnector4 (P5_EscConnector4.3), External Connectors/EscConnector5 (P5_EscConnector5.3), External Connectors/EscConnector6 (P5_EscConnector6.3), External Connectors/EscConnector7 (P5_EscConnector7.3), External Connectors/EscConnector8 (P5_EscConnector8.3)
V3.3: mcu (B2.1), sensors (B3.1), power (+3.3.1 C22.1 U3.5), connectors (B1.1 C1.1 P1.4 R1.2)
BATTM0: mcu (U1.8), connectors (BSNS0.1 R2.2 R4.1)
BATTM1: mcu (U1.9), connectors (BSNS1.1 R3.2 R5.1)
BTN0: mcu (U1.49), debug_and_interface (P4.6 SW4.2)
BTN1: mcu (U1.7), debug_and_interface (SW3.2)
DBGLED0: mcu (U1.51), debug_and_interface (P4.2 R11.2)
DBGLED1: mcu (U1.50), debug_and_interface (P4.8 R12.2)
DBGLED2: mcu (R15.2 U1.52), debug_and_interface (P4.4 R13.2)
I2C1SCL: mcu (U1.23), sensors (R25.2 SCLo.1 U5.7 U6.8)
I2C1SDA: mcu (U1.24), sensors (R26.2 SDAo.1 U5.6 U6.7)
INT_ALT: mcu (U1.60), sensors (INTa.1 JP2.1 U6.6)
INT_IMU: mcu (U1.6), sensors (INTIMU.1 U4.12)
INT_MAG: mcu (U1.59), sensors (INTm.1 U5.9)
Ne~{t}RST_1: mcu (5 pins), debug_and_interface (P4.10)
NetASS_1: mcu (U1.20), connectors (ASS.1 P1.2 R1.1)
NetDRX_1: mcu (U1.17), debug_and_interface (DRX.1), connectors (P2.3)
NetDTX_1: mcu (U1.18), debug_and_interface (DTX.1), connectors (P2.1)
NetR23_2: mcu (U1.47), sensors (R23.2 SCLi.1 U4.24)
NetR24_2: mcu (U1.48), sensors (R24.2 SDAi.1 U4.23)
NRF_CE: mcu (U1.45), connectors (NCE.1 P3.3)
NRF_CSN: mcu (U1.46), connectors (NCS.1 P3.4)
NRF_IRQ: mcu (U1.57), connectors (NIRQ.1 P3.8)
NRF_MISO: mcu (U1.21), connectors (AMISO.1 P1.7 P3.7)
NRF_MOSI: mcu (U1.22), connectors (AMOSI.1 P1.3 P3.6)
NRF_SCK: mcu (U1.19), connectors (ASCK.1 P1.5 P3.5)
PD0: mcu (U1.61), External Connectors/EscConnector1 (ESS_EscConnector1.1 P5_EscConnector1.1)
PD1: mcu (U1.62), External Connectors/EscConnector2 (ESS_EscConnector2.1 P5_EscConnector2.1)
PD2: mcu (U1.63), External Connectors/EscConnector3 (ESS_EscConnector3.1 P5_EscConnector3.1)
PD3: mcu (U1.64), External Connectors/EscConnector4 (ESS_EscConnector4.1 P5_EscConnector4.1)
PD4: mcu (U1.43), External Connectors/EscConnector5 (ESS_EscConnector5.1 P5_EscConnector5.1)
PD5: mcu (U1.44), External Connectors/EscConnector6 (ESS_EscConnector6.1 P5_EscConnector6.1)
PD6: mcu (U1.53), External Connectors/EscConnector7 (ESS_EscConnector7.1 P5_EscConnector7.1)
PD7: mcu (U1.10), External Connectors/EscConnector8 (ESS_EscConnector8.1 P5_EscConnector8.1)
SSI2Clk: mcu (U1.58), External Connectors/EscConnector1 (P5_EscConnector1.4), External Connectors/EscConnector2 (P5_EscConnector2.4), External Connectors/EscConnector3 (P5_EscConnector3.4), External Connectors/EscConnector4 (P5_EscConnector4.4), External Connectors/EscConnector5 (P5_EscConnector5.4), External Connectors/EscConnector6 (P5_EscConnector6.4), External Connectors/EscConnector7 (P5_EscConnector7.4), External Connectors/EscConnector8 (P5_EscConnector8.4)
SSI2Rx: mcu (U1.1), External Connectors/EscConnector1 (P5_EscConnector1.6), External Connectors/EscConnector2 (P5_EscConnector2.6), External Connectors/EscConnector3 (P5_EscConnector3.6), External Connectors/EscConnector4 (P5_EscConnector4.6), External Connectors/EscConnector5 (P5_EscConnector5.6), External Connectors/EscConnector6 (P5_EscConnector6.6), External Connectors/EscConnector7 (P5_EscConnector7.6), External Connectors/EscConnector8 (P5_EscConnector8.6)
SSI2Tx: mcu (U1.4), External Connectors/EscConnector1 (P5_EscConnector1.5), External Connectors/EscConnector2 (P5_EscConnector2.5), External Connectors/EscConnector3 (P5_EscConnector3.5), External Connectors/EscConnector4 (P5_EscConnector4.5), External Connectors/EscConnector5 (P5_EscConnector5.5), External Connectors/EscConnector6 (P5_EscConnector6.5), External Connectors/EscConnector7 (P5_EscConnector7.5), External Connectors/EscConnector8 (P5_EscConnector8.5)
T0CCP0: mcu (U1.28), connectors (P8.7)
T0CCP1: mcu (U1.29), connectors (P8.8)
T1CCP0: mcu (U1.30), connectors (PROBE.1 R20.2)
T1CCP1: mcu (U1.31), connectors (ECHO.1 P14.4)
T2CCP0: mcu (U1.5), debug_and_interface (R14.2)
WT0CCP0: mcu (U1.16), connectors (P8.4)
WT0CCP1: mcu (U1.15), connectors (P8.5)
WT1CCP0: mcu (U1.14), connectors (P8.6)
WT1CCP1: mcu (U1.13), connectors (P8.3)

## Assembly variants
Full: not fitted Q? R?